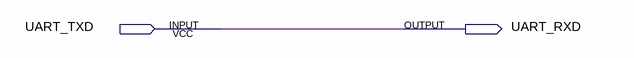
[diagram p0: schematic sheet]
// Quartus schematic Project2.bdf as structural Verilog: 0 symbols, 2 pins
module Project2 (
  input  UART_TXD,
  output UART_RXD
);


  assign UART_RXD = UART_TXD;
endmodule
